# EAGLE design lpc812bed (EAGLE 6.4)
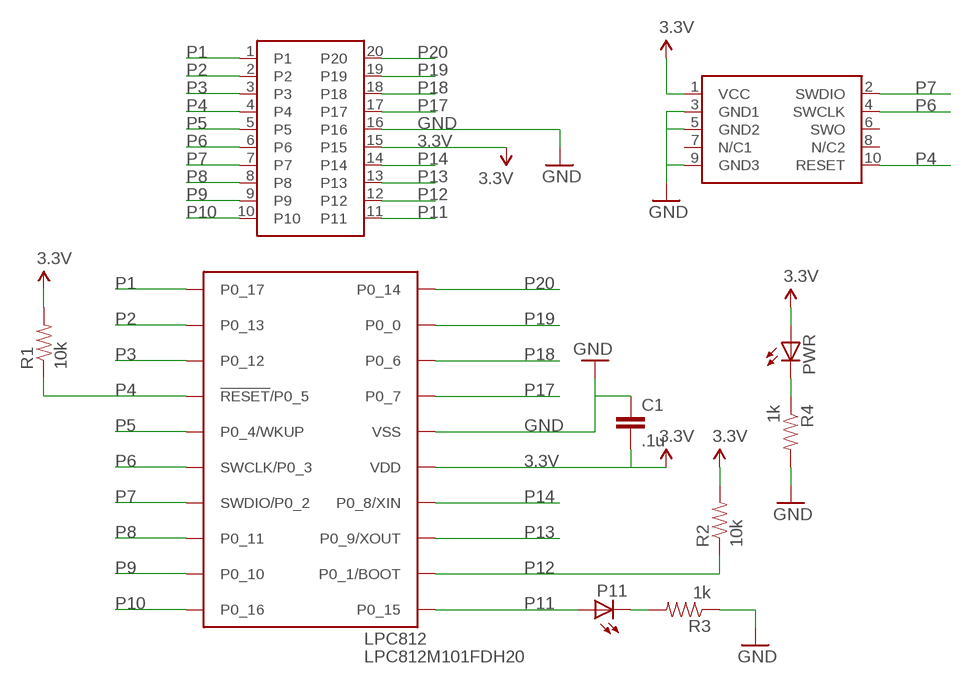
[diagram p0: schematic, sheet 1]

## Parts
C1  .1u  CAP0805  [0805]
LPC812  LPC812M101FDH20  [TSSOP20]
P11  LED1206  [LED-1206]
PWR  LED1206  [LED-1206]
R1  10k  RESISTOR1206  [1206]
R2  10k  RESISTOR1206  [1206]
R3  1k  RESISTOR1206  [1206]
R4  1k  RESISTOR1206  [1206]
SWD1  CORTEX_SWD  [M50-3600542]
U$2  LPCBOARD  [LPCBOARD_SPACERS]

## Nets
3.3V: C1.2 LPC812.15(VDD) PWR.A R1.2 R2.2 SWD1.1(VCC) U$2.15
GND: C1.1 LPC812.16(VSS) R3.1 R4.2 SWD1.3(GND1) SWD1.5(GND2) SWD1.9(GND3) U$2.16
N$1: P11.C R3.2
N$2: PWR.C R4.1
P1: LPC812.1(P0_17) U$2.1
P2: LPC812.2(P0_13) U$2.2
P3: LPC812.3(P0_12) U$2.3
P4: LPC812.4(!RESET!/P0_5) R1.1 SWD1.10(RESET) U$2.4
P5: LPC812.5(P0_4/WKUP) U$2.5
P6: LPC812.6(SWCLK/P0_3) SWD1.4(SWCLK) U$2.6
P7: LPC812.7(SWDIO/P0_2) SWD1.2(SWDIO) U$2.7
P8: LPC812.8(P0_11) U$2.8
P9: LPC812.9(P0_10) U$2.9
P10: LPC812.10(P0_16) U$2.10
P11: LPC812.11(P0_15) P11.A U$2.11
P12: LPC812.12(P0_1/BOOT) R2.1 U$2.12
P13: LPC812.13(P0_9/XOUT) U$2.13
P14: LPC812.14(P0_8/XIN) U$2.14
P17: LPC812.17(P0_7) U$2.17
P18: LPC812.18(P0_6) U$2.18
P19: LPC812.19(P0_0) U$2.19
P20: LPC812.20(P0_14) U$2.20
Unconnected: SWD1.6(SWO) SWD1.7(N/C1) SWD1.8(N/C2)

## Library data of the parts
C1 = SparkFun-Capacitors:CAP: Capacitor Standard 0603 ceramic capacitor, and 0.1" leaded capacitor.
LPC812 = carrilib:LPC812M101FDH20
P11 PWR = SparkFun-LED:LED: LEDs Standard schematic elements and footprints for 5mm, 3mm, 1206, and 0603 sized LEDs. 5mm - Spark Fun Electronics SKU : COM-00529 (and others)
R1-R4 = SparkFun-Resistors:RESISTOR: Resistor Basic schematic elements and footprints for 0603, 1206, and PTH resistors.
SWD1 = carrilib:CORTEX_SWD: .05" Cortex M Connector in SWD mode Manufacturer: Generic Part Number: Cortex M SWD Notes: I use Harwin M50-3600542 connectors
U$2 = boardcons:LPCBOARD

## Board
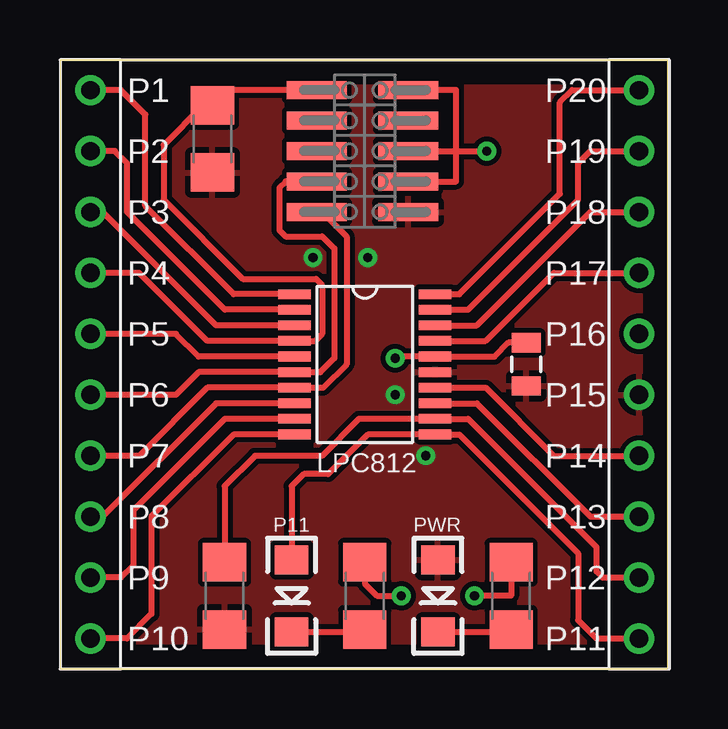
[diagram p1: board, top side]
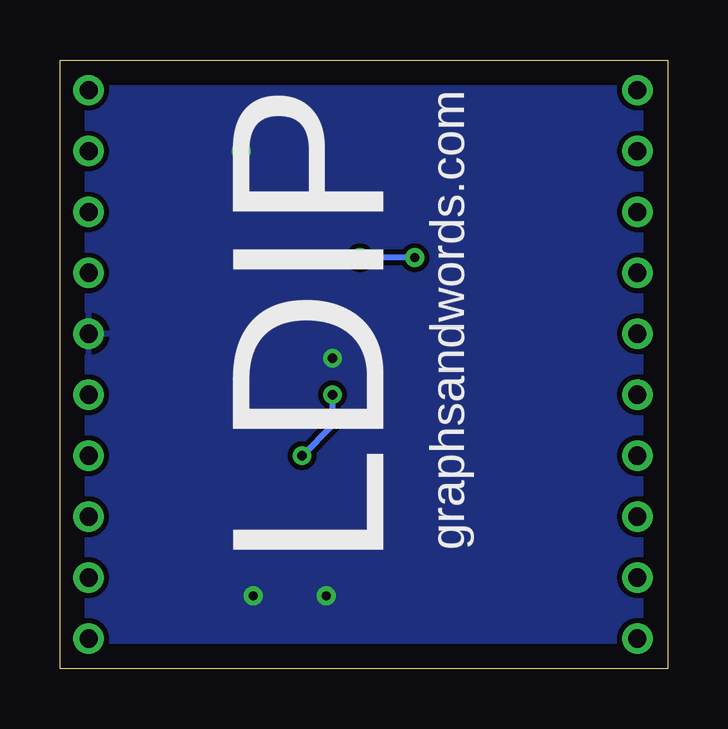
[diagram p2: board, bottom side, seen from below]

Size 25.32 x 25.39 mm. Coordinates in mm from the lower left corner, seen from the top.
Outline: 0,0 25.32,0 25.32,25.39 0,25.39 0,0
Copper layers (1*16): Top 0.035mm / dielectric 1.5mm / Bottom 0.035mm
Design rules "default": minimum track width 10mil, minimum drill 24mil, track to track 8mil, track to pad 8mil, pad to pad 8mil, via to via 8mil, smd to smd 8mil, copper to edge 40mil, drill to drill 8mil, minimum pad ring 10mil, minimum via ring 8mil, stop-mask expansion 4mil, vias tented up to drill 0mil, thermal gap 10mil

### Footprints (pad centres in the part's own frame; a part is rotated, then mirrored left to right if it is on the bottom)
0805 = smd 0.8 x 1.2: 1 -0.9,0; 2 0.9,0
TSSOP20 = smd 1.35 x 0.4: 1 -2.925,2.925; 2 -2.925,2.275; 3 -2.925,1.625; 4 -2.925,0.975; 5 -2.925,0.325; 6 -2.925,-0.325; 7 -2.925,-0.975; 8 -2.925,-1.625; 9 -2.925,-2.275; 10 -2.925,-2.925; 11 2.925,-2.925; 12 2.925,-2.275; 13 2.925,-1.625; 14 2.925,-0.975; 15 2.925,-0.325; 16 2.925,0.325; 17 2.925,0.975; 18 2.925,1.625; 19 2.925,2.275; 20 2.925,2.925
LED-1206 = smd 1.2 x 1.4: A -1.5,0; C 1.5,0
1206 = smd 1.6 x 1.8: 1 -1.4,0; 2 1.4,0
M50-3600542 = smd 0.75 x 2.5: 1 -2.54,-1.81; 2 -2.54,2; 3 -1.27,-1.81; 4 -1.27,2; 5 0,-1.81; 6 0,2; 7 1.27,-1.81; 8 1.27,2; 9 2.54,-1.81; 10 2.54,2
LPCBOARD_SPACERS = drill 0.762: 1 -11.43,11.43; 2 -11.43,8.89; 3 -11.43,6.35; 4 -11.43,3.81; 5 -11.43,1.27; 6 -11.43,-1.27; 7 -11.43,-3.81; 8 -11.43,-6.35; 9 -11.43,-8.89; 10 -11.43,-11.43; 11 11.43,-11.43; 12 11.43,-8.89; 13 11.43,-6.35; 14 11.43,-3.81; 15 11.43,-1.27; 16 11.43,1.27; 17 11.43,3.81; 18 11.43,6.35; 19 11.43,8.89; 20 11.43,11.43

### Placement (x,y rotation side)
C1  19.43,12.7 270 top
LPC812  12.7,12.7 0 top
P11  9.65,3.05 270 top
PWR  15.75,3.05 270 top
R1  6.35,22.1 270 top
R2  6.86,3.05 270 top
R3  12.7,3.05 270 top
R4  18.8,3.05 90 top
SWD1  12.7,21.59 90 top
U$2  12.7,12.7 0 top

### Tracks (layer width: path | path; a pad name or v marks a point on that pad's centre or on a via)
3.3V  (via drill 0.38)
  Bottom 0.254: v13.97,11.43 13.97,10.16 v15.24,8.89 | v10.54,17.14 v12.83,17.14
  pour Top: 0,0 25.4,0 25.4,25.4 0,25.4
GND  (via drill 0.38)
  Top 0.254: R4.2 18.8,3.05 v17.27,3.05 | R3.1 12.7,3.56 13.21,3.05 v14.22,3.05 | v13.97,12.95 14.04,13.03 LPC812.16 18.11,13.03 18.68,13.6 C1.1 | SWD1.3 16.51,20.32 16.51,21.59 | 16.51,21.59 16.51,24.13 SWD1.9 | SWD1.5 16.51,21.59 | 16.51,21.59 v17.78,21.59
  pour Bottom: 0,0 25.4,0 25.4,26.67 0,26.67
N$1
  Top 0.254: P11.C 12.7,1.55 R3.2
N$2
  Top 0.254: PWR.C 19.3,1.55 R4.1
P1
  Top 0.254: LPC812.1 7.24,15.62 3.56,19.3 3.56,23.11 2.54,24.13 U$2.1
P2
  Top 0.254: LPC812.2 6.87,14.97 2.79,19.05 2.79,21.08 2.29,21.59 U$2.2
P3
  Top 0.254: LPC812.3 6.5,14.32 1.78,19.05 U$2.3
P4
  Top 0.254: U$2.4 3.3,16.51 6.14,13.68 LPC812.4 10.63,13.68 10.92,13.97 10.92,16 10.67,16.26 7.62,16.26 4.32,19.56 4.32,21.84 5.97,23.5 R1.1 6.98,24.13 SWD1.10
P5
  Top 0.254: LPC812.5 5.77,13.03 4.83,13.97 U$2.5
P6
  Top 0.254: U$2.6 4.83,11.43 5.77,12.38 LPC812.6 10.85,12.38 11.43,12.95 11.43,17.53 10.92,18.03 9.4,18.03 9.14,18.29 9.14,20.07 9.4,20.32 SWD1.4
P7
  Top 0.254: U$2.7 3.3,8.89 6.14,11.72 LPC812.7 10.96,11.72 11.94,12.7 11.94,18.03 10.92,19.05 SWD1.2
P8
  Top 0.254: LPC812.8 6.5,11.07 1.78,6.35 U$2.8
P9
  Top 0.254: LPC812.9 6.87,10.43 3.05,6.6 3.05,4.32 2.54,3.81 U$2.9
P10
  Top 0.254: LPC812.10 7.24,9.78 3.81,6.35 3.81,2.29 2.79,1.27 U$2.10
P11
  Top 0.254: P11.A 9.65,7.62 10.16,8.13 11.18,8.13 12.82,9.78 LPC812.11 16.64,9.78 21.59,4.83 21.59,2.03 22.35,1.27 U$2.11
P12
  Top 0.254: R2.1 6.86,7.62 8.13,8.89 10.92,8.89 12.46,10.43 LPC812.12 17.01,10.43 22.35,5.08 22.35,4.06 22.61,3.81 U$2.12
P13
  Top 0.254: LPC812.13 17.37,11.07 22.1,6.35 U$2.13
P14
  Top 0.254: LPC812.14 17.74,11.72 20.57,8.89 U$2.14
P17
  Top 0.254: LPC812.17 17.74,13.68 20.57,16.51 U$2.17
P18
  Top 0.254: LPC812.18 17.37,14.32 22.1,19.05 U$2.18
P19
  Top 0.254: LPC812.19 17.01,14.97 21.59,19.56 21.59,21.08 22.1,21.59 U$2.19
P20
  Top 0.254: LPC812.20 16.64,15.62 20.83,19.81 20.83,23.62 21.34,24.13 U$2.20

### Text on the board
tPlace: P1 | P20 | P2 | P19 | P3 | P18 | P4 | P17 | P5 | P16 | P6 | P15 | P7 | P14 | P8 | P13 | P9 | P12 | P10 | P11
bPlace: graphsandwords.com | LDIP